# Altium schematic sheet PGA.SchDoc
size A4
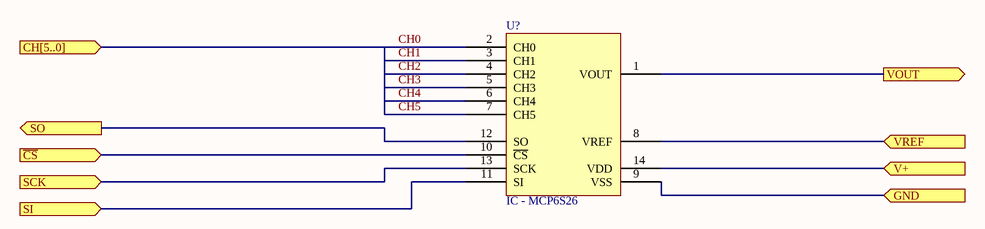
[diagram p0: PGA.SchDoc]

## Parts
U?  IC - MCP6S26  [IC-TSSOP-14]

## Ports
CH[5..0] (in), GND (in), SCK (in), SI (in), SO (out), V+ (in), VOUT (out), VREF (in), ~{CS} (in)

## Nets
~{CS}: U?.10(~{CS}) ; port ~{CS}
CH0: U?.2(CH0)
CH1: U?.3(CH1)
CH2: U?.4(CH2)
CH3: U?.5(CH3)
CH4: U?.6(CH4)
CH5: U?.7(CH5)
GND: U?.9(VSS) ; port GND
SCK: U?.13(SCK) ; port SCK
SI: U?.11(SI) ; port SI
SO: U?.12(SO) ; port SO
V+: U?.14(VDD) ; port V+
VOUT: U?.1(VOUT) ; port VOUT
VREF: U?.8(VREF) ; port VREF

## Library data of the parts
U? = IC - MCP6S26: Single-Ended, Rail-toRail I/O, Low Gain PGA